# EAGLE design mkr1000 (EAGLE 7.5.0)
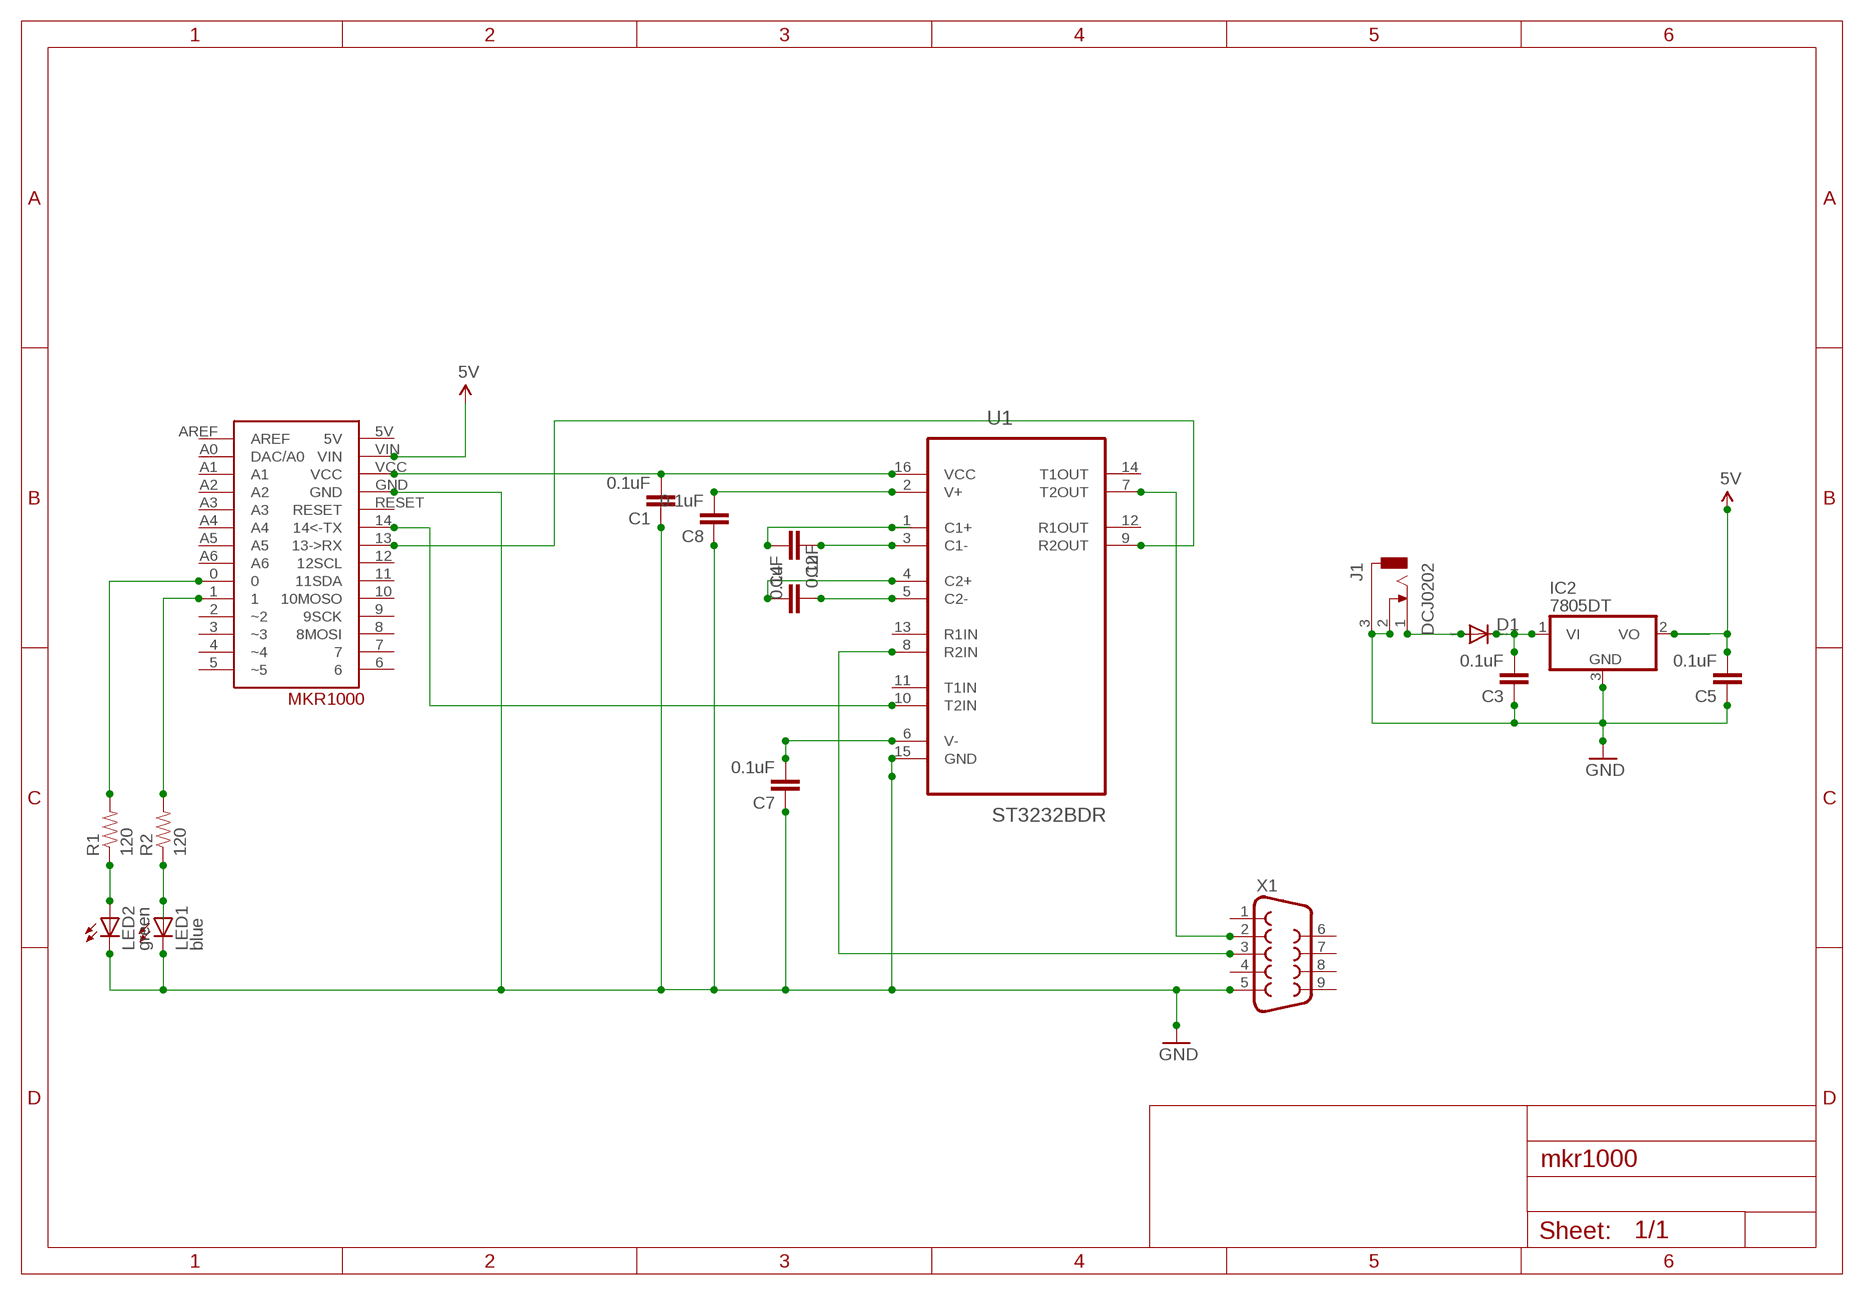
[diagram p0: schematic, sheet 1]

## Parts
C1  0.1uF  0.1UF-25V(+80/-20%)(0603)  [0603-CAP]
C2  0.1uF  0.1UF-25V(+80/-20%)(0603)  [0603-CAP]
C3  0.1uF  0.1UF-25V(+80/-20%)(0603)  [0603-CAP]
C4  0.1uF  0.1UF-25V(+80/-20%)(0603)  [0603-CAP]
C5  0.1uF  0.1UF-25V(+80/-20%)(0603)  [0603-CAP]
C7  0.1uF  0.1UF-25V(+80/-20%)(0603)  [0603-CAP]
C8  0.1uF  0.1UF-25V(+80/-20%)(0603)  [0603-CAP]
D1  DIODE-SMB  [SMB]
IC2  7805DT  [TO252]
J1  DCJ0202  [DCJ0202]
LED1  blue  LEDSML0805  [SML0805]
LED2  green  LEDSML0805  [SML0805]
MKR1000  MKR1000  [MKR1000]
R1  120  RESISTOR0805-RES  [0805]
R2  120  RESISTOR0805-RES  [0805]
U1  ST3232BDR  [SOIC127P600X175-16N]
X1  DB9FEMALE  [DB9]

## Nets
3.3V: C1.2 MKR1000.VCC U1.16(VCC)
5V: C5.2 IC2.2(VO) MKR1000.VIN
GND: C1.1 C3.1 C5.1 C7.1 C8.1 IC2.3(GND) J1.2 J1.3 LED1.C LED2.C MKR1000.GND U1.15(GND) X1.5
N$1: D1.A J1.1
N$2: C3.2 D1.C IC2.1(VI)
N$3: LED2.A R1.1
N$4: U1.7(T2OUT) X1.2
N$6: C7.2 U1.6(V-)
N$7: C8.2 U1.2(V+)
N$8: C2.2 U1.1(C1+)
N$9: C2.1 U1.3(C1-)
N$10: C4.1 U1.4(C2+)
N$12: C4.2 U1.5(C2-)
N$13: MKR1000.14(14<-TX) U1.10(T2IN)
N$15: LED1.A R2.1
N$17: MKR1000.0 R1.2
N$18: MKR1000.1 R2.2
N$19: U1.8(R2IN) X1.3
N$20: MKR1000.13(13->RX) U1.9(R2OUT)
Unconnected: MKR1000.2(~2) MKR1000.3(~3) MKR1000.4(~4) MKR1000.5(~5) MKR1000.5V MKR1000.6 MKR1000.7 MKR1000.8(8MOSI) MKR1000.9(9SCK) MKR1000.10(10MOSO) MKR1000.11(11SDA) MKR1000.12(12SCL) MKR1000.A0(DAC/A0) MKR1000.A1 MKR1000.A2 MKR1000.A3 MKR1000.A4 MKR1000.A5 MKR1000.A6 MKR1000.AREF MKR1000.RESET U1.11(T1IN) U1.12(R1OUT) U1.13(R1IN) U1.14(T1OUT) X1.1 X1.4 X1.6 X1.7 X1.8 X1.9

## Library data of the parts
C1-C5 C7 C8 = SparkFun-Capacitors:0.1UF-25V(+80/-20%)(0603): CAP-00810 Ceramic Standard decoupling cap; PROD_ID: CAP-00810
D1 = diode:DIODE-: DIODE
IC2 = adafruit:78*: Positive VOLTAGE REGULATOR Added bigger pads to the TO-92 package
J1 = con-jack:DCJ0202: DC POWER JACK Source: DCJ0202.pdf; OC_FARNELL: unknown; OC_NEWARK: unknown
LED1 LED2 = led:LED: LED OSRAM: - CHIPLED LG R971, LG N971, LY N971, LG Q971, LY Q971, LO R971, LY R971 LH N974, LH R974 LS Q976, LO Q976, LY Q976 LO Q996 - Hyper CHIPLED LW Q18S LB Q993, LB Q99A, LB R99A - SideLED LS A670, LO A670, LY A670, LG A670, LP A670 LB A673, LV A673, LT A673, LW A673 LH A674 LY A675 LS A676, LA A676, LO A676, LY A676, LW A676 LS A679, LY A679, LG A679 - Hyper Micro SIDELED® LS Y876, LA Y876, LO Y876, LY Y876 LT Y87S - SmartLED LW L88C, LW L88S LB L89C, LB L89S, LG L890 LS L89K, LO L89K, LY L89K LS L896, LA L896, LO L896, LY L896 - TOPLED LS T670, LO T670, LY T670, LG T670, LP T670 LSG T670, LSP T670, LSY T670, LOP T670, LYG T670 LG T671, LOG T671, LSG T671 LB T673, LV T673, LT T673, LW T673 LH T674 LS T676, LA T676, LO T676, LY T676, LB T676, LH T676, LSB T676, LW T676 LB T67C, LV T67C, LT T67C, LS T67K, LO T67K, LY T67K, LW E67C LS E67B, LA E67B, LO E67B, LY E67B, LB E67C, LV E67C, LT E67C LW T67C LS T679, LY T679, LG T679 LS T770, LO T770, LY T770, LG T770, LP T770 LB T773, LV T773, LT T773, LW T773 LH T774 LS E675, LA E675, LY E675, LS T675 LS T776, LA T776, LO T776, LY T776, LB T776 LHGB T686 LT T68C, LB T68C - Hyper Mini TOPLED® LB M676 - Mini TOPLED Santana® LG M470 LS M47K, LO M47K, LY M47K Source: http://www.osram.convergy.de LUXEON: - LUMILED® LXK2-PW12-R00, LXK2-PW12-S00, LXK2-PW14-U00, LXK2-PW14-V00 LXK2-PM12-R00, LXK2-PM12-S00, LXK2-PM14-U00 LXK2-PE12-Q00, LXK2-PE12-R00, LXK2-PE12-S00, LXK2-PE14-T00, LXK2-PE14-U00 LXK2-PB12-K00, LXK2-PB12-L00, LXK2-PB12-M00, LXK2-PB14-N00, LXK2-PB14-P00, LXK2-PB14-Q00 LXK2-PR12-L00, LXK2-PR12-M00, LXK2-PR14-Q00, LXK2-PR14-R00 LXK2-PD12-Q00, LXK2-PD12-R00, LXK2-PD12-S00 LXK2-PH12-R00, LXK2-PH12-S00 LXK2-PL12-P00, LXK2-PL12-Q00, LXK2-PL12-R00 Source: www.luxeon.com KINGBRIGHT: KA-3528ASYC Source: www.kingbright.com
MKR1000 = aHANNES:MKR1000
R1 R2 = SparkFun-Passives:RESISTOR: Resistor Basic schematic elements and footprints for 0603, 1206, and PTH resistors.
U1 = ST Microelctronics_By_element14_Batch_1:ST3232BDR: RS-232 drivers and receivers; MPN: ST3232BDR; OC_FARNELL: 1467752; OC_NEWARK: 89K1000; PACKAGE: SOIC-16; SUPPLIER: STMICROELECTRONICS
X1 = SparkFun-Connectors:DB9: DB9 Connector Standard DB9 (D-Sub 9) serial connector. Can be used for CAN bus as well as RS485 and RS232. Footprint production proven. Spark Fun Electronics SKU : PRT-00429

## Board
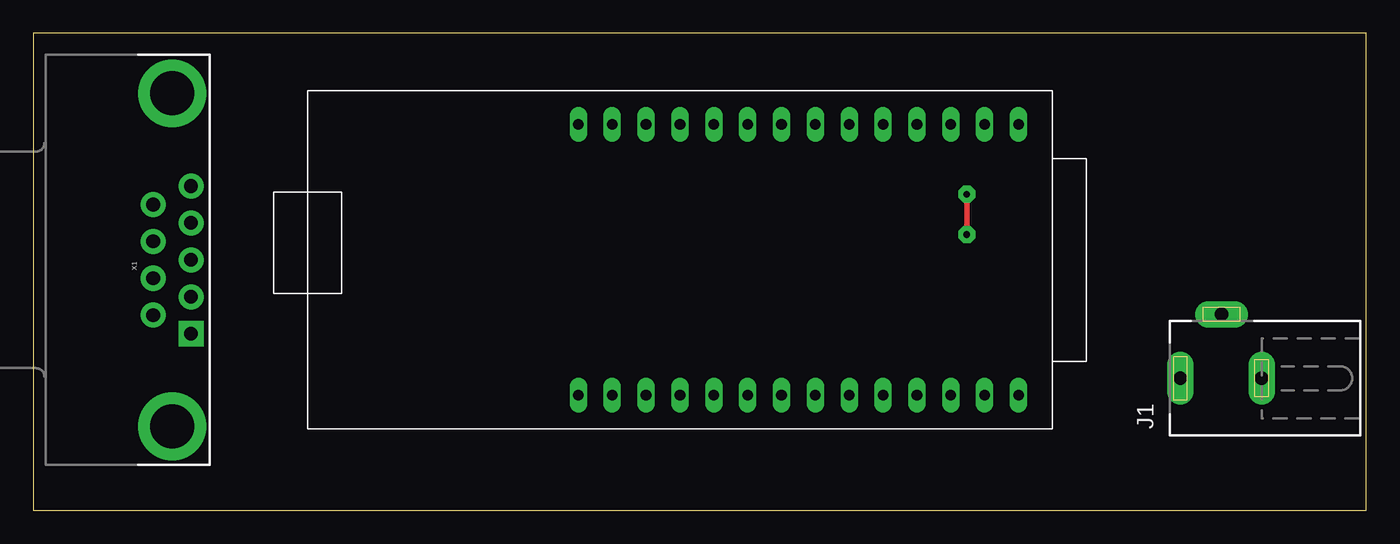
[diagram p1: board, top side]
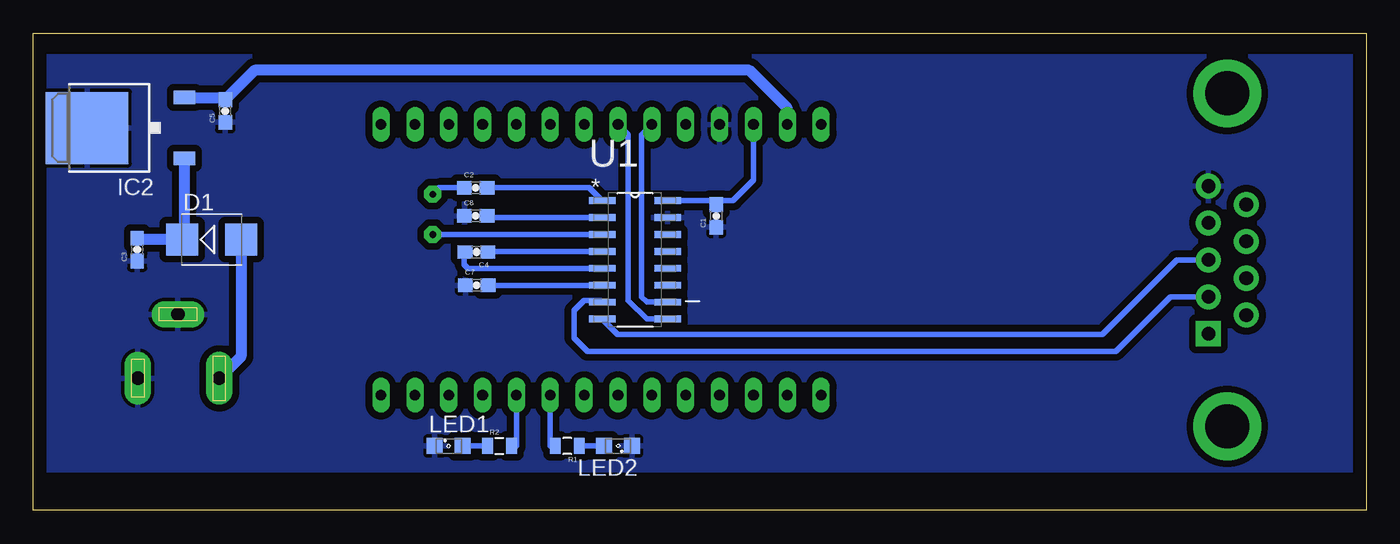
[diagram p2: board, bottom side, seen from below]

Size 100 x 35.8 mm. Coordinates in mm from the lower left corner, seen from the top.
Outline: 0,0 100,0 100,35.8 0,35.8 0,0
Copper layers (1*16): Top 0.035mm / dielectric 1.5mm / Bottom 0.035mm
Design rules "default": minimum track width 10mil, minimum drill 24mil, track to track 8mil, track to pad 8mil, pad to pad 8mil, via to via 8mil, smd to smd 8mil, copper to edge 40mil, drill to drill 8mil, minimum pad ring 10mil, minimum via ring 8mil, stop-mask expansion 4mil, vias tented up to drill 0mil, thermal gap 10mil

### Footprints (pad centres in the part's own frame; a part is rotated, then mirrored left to right if it is on the bottom)
0603-CAP = smd 1.1 x 1: 1 -0.85,0; 2 0.85,0
SMB = smd 2.4 x 2.4: A 2.2,0; C -2.2,0
TO252 = smd 1 x 1.6: 1 -2.28,-4.8; 2 2.28,-4.8 | smd 5.4 x 6.2: 3 0,2.5
DCJ0202 = drill 1 pad 2 long: 1 0,3.1; 2 4.8,0; 3 0,-3
SML0805 = smd 1.2 x 1.2: A 1.05,0; C -1.05,0
MKR1000 = drill 0.8 long: 0 -10.16,5.08; 1 -10.16,2.54; 2 -10.16,0; 3 -10.16,-2.54; 4 -10.16,-5.08; 5 -10.16,-7.62; 5V 10.16,25.4; 6 10.16,-7.62; 7 10.16,-5.08; 8 10.16,-2.54; 9 10.16,0; 10 10.16,2.54; 11 10.16,5.08; 12 10.16,7.62; 13 10.16,10.16; 14 10.16,12.7; A0 -10.16,22.86; A1 -10.16,20.32; A2 -10.16,17.78; A3 -10.16,15.24; A4 -10.16,12.7; A5 -10.16,10.16; A6 -10.16,7.62; AREF -10.16,25.4; GND 10.16,17.78; RESET 10.16,15.24; VCC 10.16,20.32; VIN 10.16,22.86
0805 = smd 0.8 x 1.2: 1 -0.9,0; 2 0.9,0
SOIC127P600X175-16N = smd 1.981 x 0.508: 1 -2.464,4.445; 2 -2.464,3.175; 3 -2.464,1.905; 4 -2.464,0.635; 5 -2.464,-0.635; 6 -2.464,-1.905; 7 -2.464,-3.175; 8 -2.464,-4.445; 9 2.464,-4.445; 10 2.464,-3.175; 11 2.464,-1.905; 12 2.464,-0.635; 13 2.464,0.635; 14 2.464,1.905; 15 2.464,3.175; 16 2.464,4.445
DB9 = drill 1.016 pad 1.88 square: 1 -5.54,-1.42 | drill 1.016 pad 1.88: 2 -2.77,-1.42; 3 0,-1.42; 4 2.77,-1.42; 5 5.54,-1.42; 6 -4.15,1.42; 7 -1.38,1.42; 8 1.38,1.42; 9 4.15,1.42 | drill 3.302 pad 5.08: G1 -12.5,0; G2 12.5,0

### Placement (x,y rotation side)
C1  48.77,22.1 90 bottom
C2  66.8,24.21 0 bottom
C3  92.2,19.56 90 bottom
C4  66.75,19.38 180 bottom
C5  85.6,29.97 90 bottom
C7  66.73,16.89 0 bottom
C8  66.8,22.1 0 bottom
D1  86.61,20.32 0 bottom
IC2  93.47,28.7 90 bottom
J1  89.15,9.91 90 top
LED1  68.83,4.83 0 bottom
LED2  56.13,4.83 180 bottom
MKR1000  66.29,18.8 90 top
R1  59.94,4.83 180 bottom
R2  65.02,4.83 0 bottom
U1  54.86,18.8 0 bottom
X1  10.41,18.8 90 top

### Tracks (layer width: path | path; a pad name or v marks a point on that pad's centre or on a via)
3.3V
  Bottom 0.406: U1.16 48.77,23.24 | 48.77,23.24 C1.2 | 48.77,23.24 47.5,23.24 45.97,24.77 MKR1000.VCC
5V
  Bottom 0.813: MKR1000.VIN 43.43,30.17 46.28,33.02 83.4,33.02 C5.2 85.76,30.98 IC2.2
GND
  pour Bottom (isolate 0.508): 0.25,34.04 100.58,34.04 100.58,3.05 0.25,3.05
N$1
  Bottom 0.813: D1.A 84.41,11.55 J1.1
N$2
  Bottom 0.813: IC2.1 88.67,20.46 D1.C 92.11,20.32 C3.2
N$3
  Bottom 0.406: LED2.A R1.1
N$4
  Bottom 0.406: X1.2 14.71,16.03 18.8,11.94 58.42,11.94 59.44,12.95 59.44,14.99 58.67,15.75 57.45,15.75 U1.7
N$6
  Bottom 0.406: U1.6 C7.2
N$7
  Bottom 0.406: U1.2 65.83,21.97 C8.2
N$8
  Bottom 0.406: C2.2 58.29,24.21 U1.1
N$9  (via drill 0.5 pad 1.27)
  Top 0.406: v70.03,20.7 v70.03,23.72
  Bottom 0.406: U1.3 v70.03,20.7 | C2.1 69.55,24.21 v70.03,23.72
N$10
  Bottom 0.406: U1.4 65.85,19.43 C4.1
N$12
  Bottom 0.406: U1.5 67.39,18.16 67.67,18.44 67.67,19.32 C4.2
N$13
  Bottom 0.406: U1.10 53.97,15.62 54.36,16 54.36,28.19 MKR1000.14
N$15
  Bottom 0.406: R2.1 LED1.A
N$17
  Bottom 0.406: R1.2 61.21,4.83 MKR1000.0
N$18
  Bottom 0.406: R2.2 63.75,4.83 MKR1000.1
N$19
  Bottom 0.406: X1.3 14.22,18.8 19.81,13.21 56.18,13.21 U1.8
N$20
  Bottom 0.406: U1.9 53.97,14.35 55.37,15.75 55.37,28.19 MKR1000.13